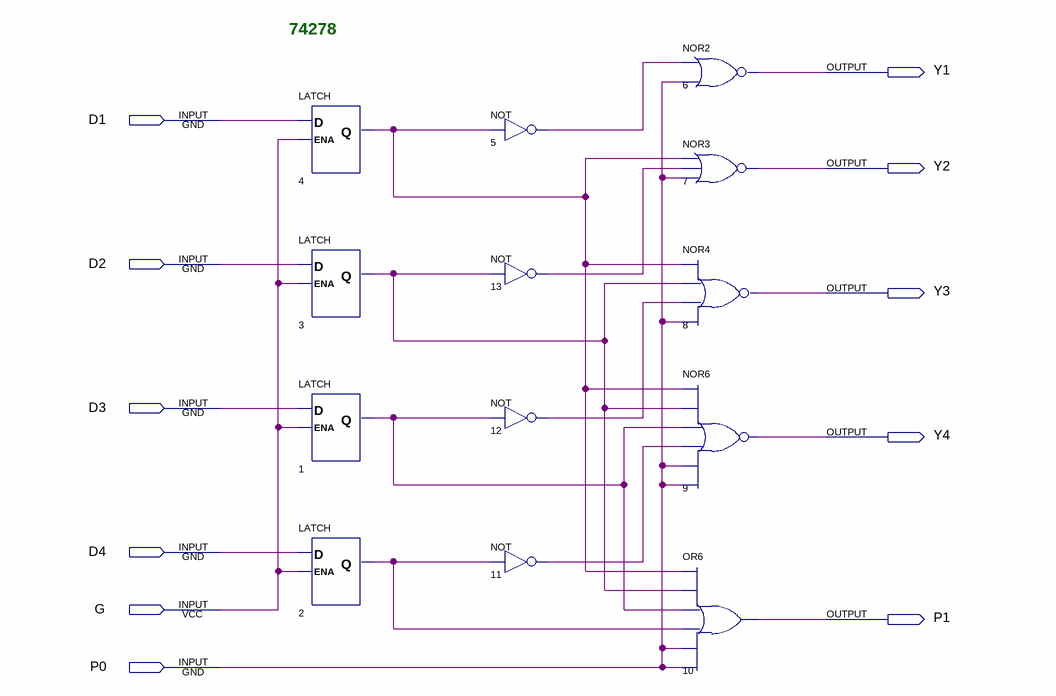
[diagram p0: schematic sheet]
// Quartus schematic 74278.bdf as structural Verilog: 13 symbols, 11 pins
module \74278  (
  input  D1,
  input  D2,
  input  D3,
  input  D4,
  input  G,
  input  P0,
  output Y1,
  output Y2,
  output Y3,
  output Y4,
  output P1
);

  wire n1_q, n2_q, n3_q, n4_q, n5_out, n11_out, n12_out, n13_out;

  LATCH u_4 (.D(D1), .ENA(G), .Q(n4_q));
  LATCH u_3 (.D(D2), .ENA(G), .Q(n3_q));
  LATCH u_1 (.D(D3), .ENA(G), .Q(n1_q));
  LATCH u_2 (.D(D4), .ENA(G), .Q(n2_q));
  not u_5 (n5_out, n4_q);
  not u_13 (n13_out, n3_q);
  not u_12 (n12_out, n1_q);
  not u_11 (n11_out, n2_q);
  nor u_6 (Y1, n5_out, P0);
  nor u_7 (Y2, n4_q, n13_out, P0);
  nor u_8 (Y3, n4_q, n3_q, n12_out, P0);
  nor u_9 (Y4, n4_q, n3_q, n1_q, n11_out, P0, P0);
  or u_10 (P1, n4_q, n3_q, n1_q, n2_q, P0, P0);

  // Notes on the sheet:
  //   74278
endmodule
